# EasyEDA Pro project chunithm.epro, schematic Schematic3
Create Date: 2023-06-27; Page Name: P1; Project Name: chunithm_psoc; Schematic Name: Schematic3; Update Date: 2023-06-28; Company: 嘉立创EDA; Page Size: A3; Version: V1.0
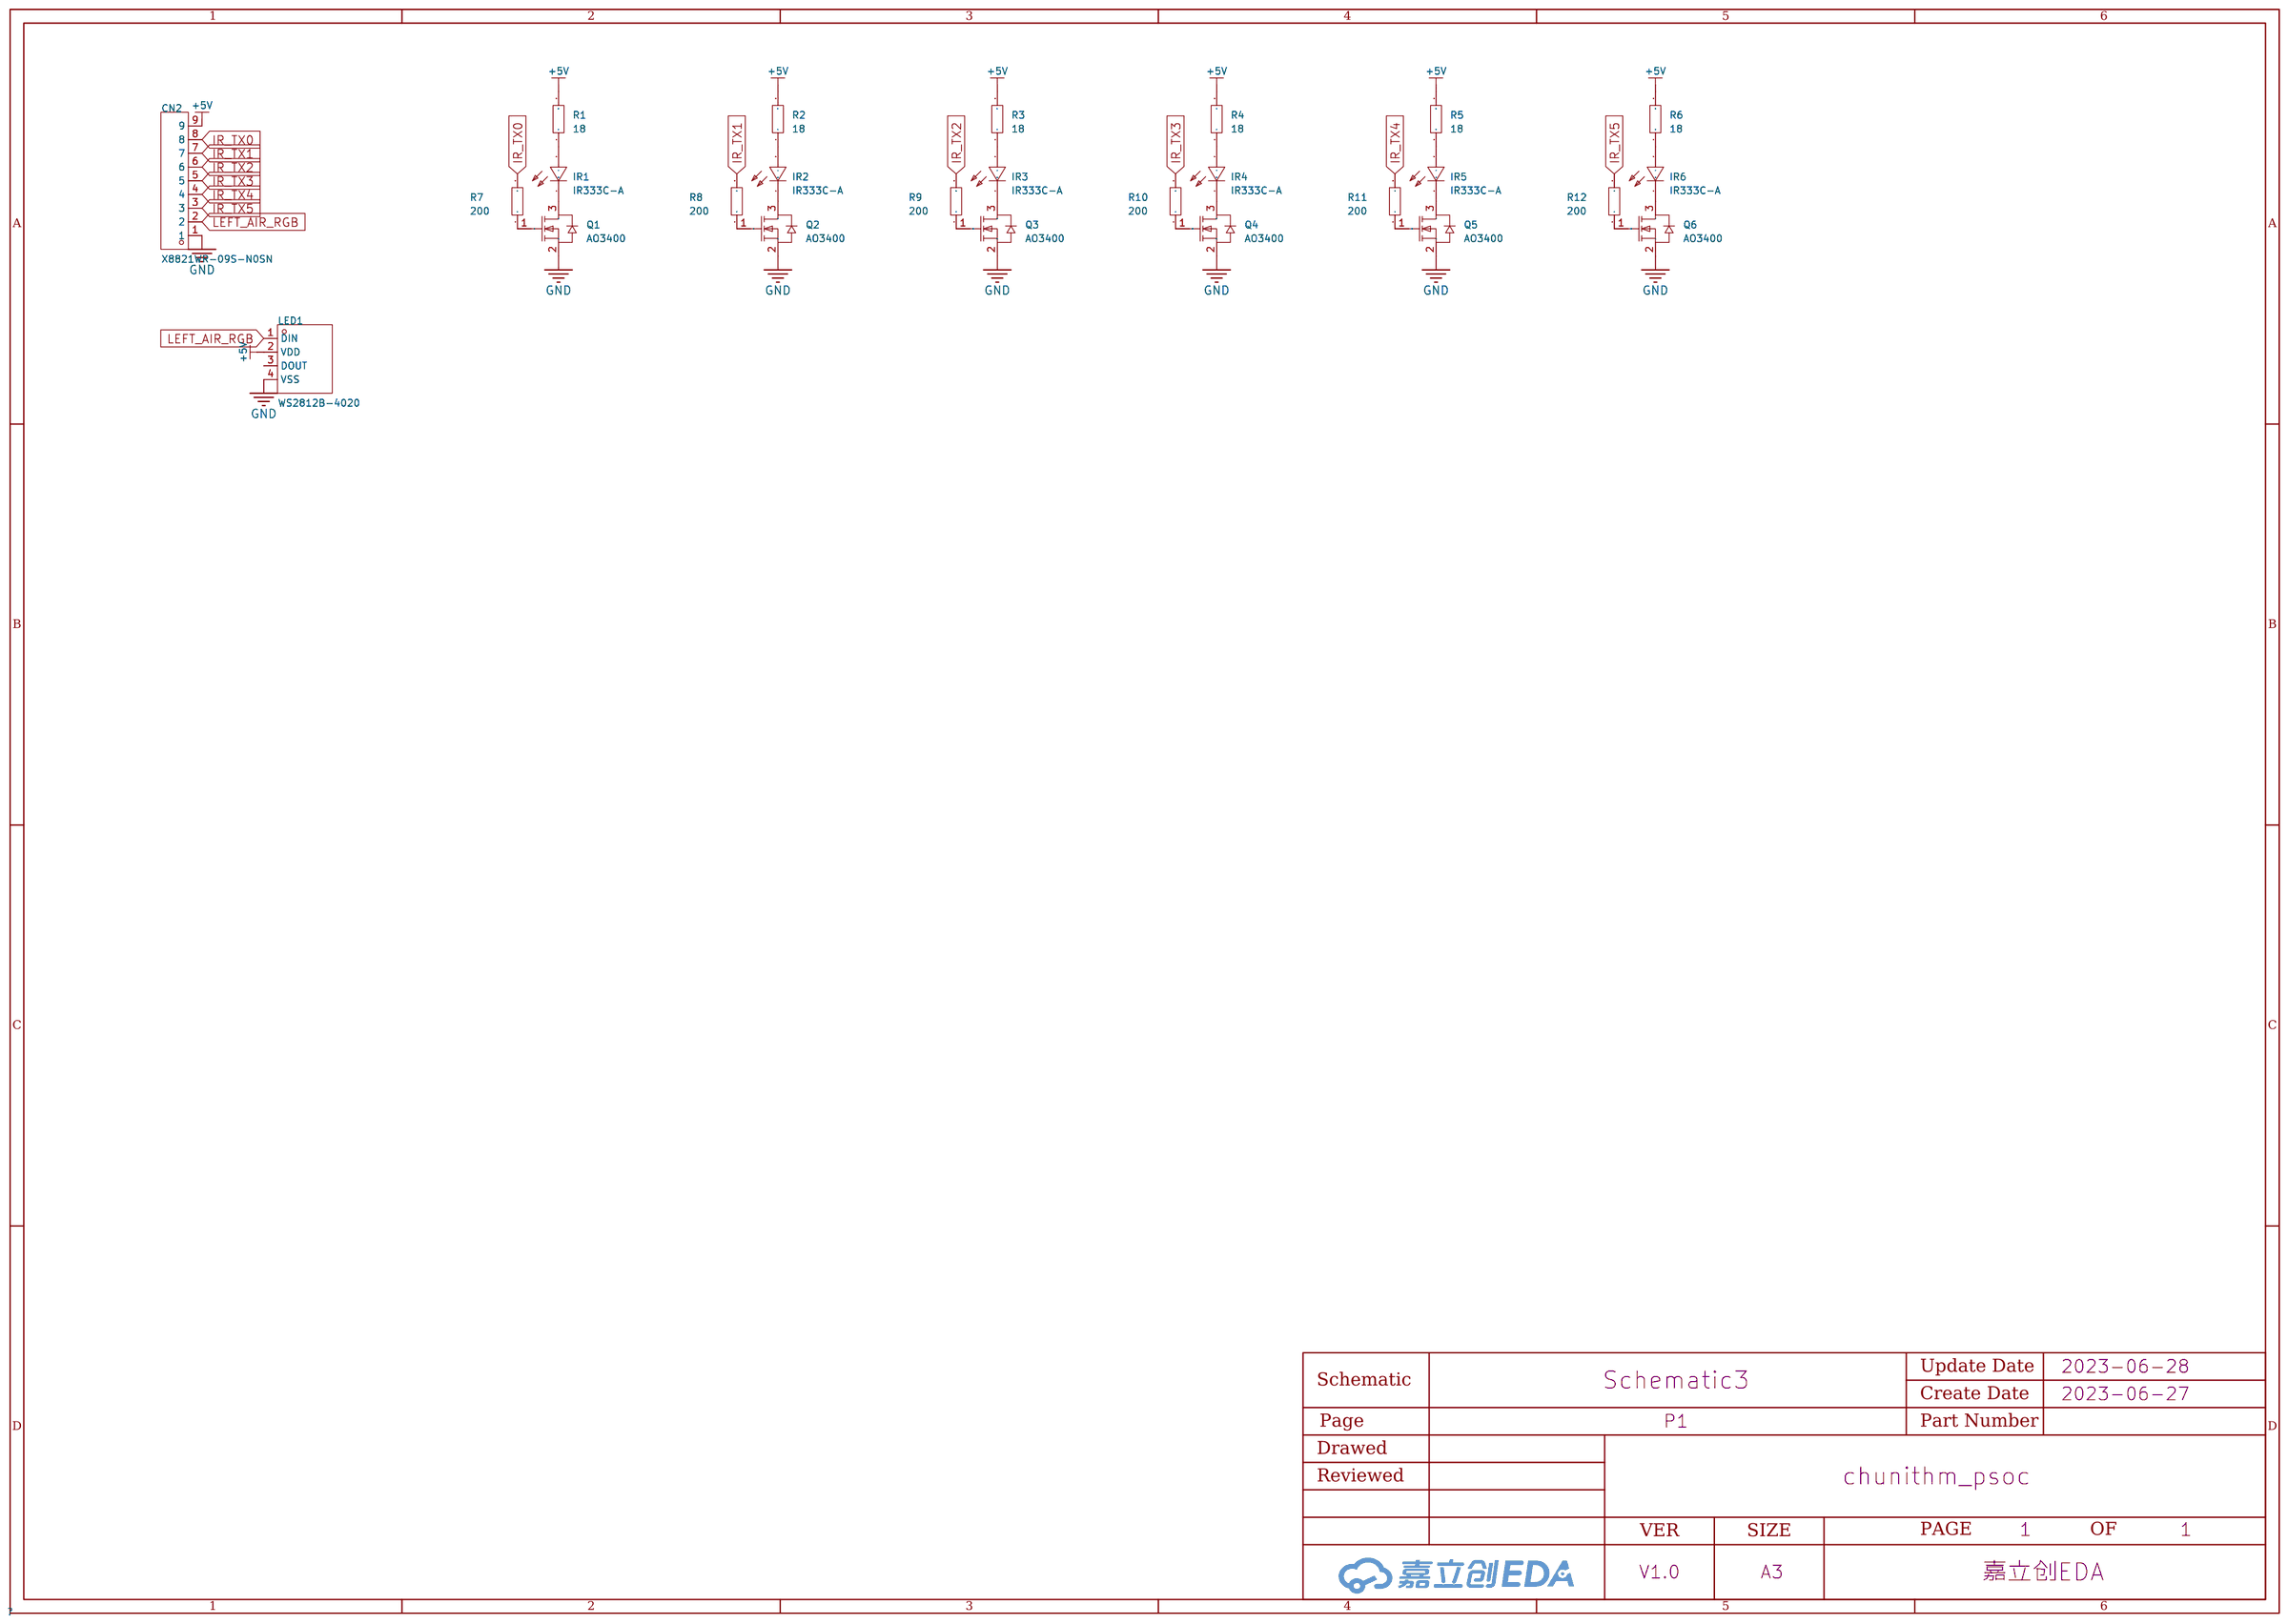
[diagram p1: schematic sheet]

## Parts
CN2  X8821WR-09S-N0SN  [CONN-TH_9P-P2.50_X8821WR-09S-N2SN]
IR1  IR333C-A  [LED-TH_BD5.9-P2.54-RD_WHITE]
IR2  IR333C-A  [LED-TH_BD5.9-P2.54-RD_WHITE]
IR3  IR333C-A  [LED-TH_BD5.9-P2.54-RD_WHITE]
IR4  IR333C-A  [LED-TH_BD5.9-P2.54-RD_WHITE]
IR5  IR333C-A  [LED-TH_BD5.9-P2.54-RD_WHITE]
IR6  IR333C-A  [LED-TH_BD5.9-P2.54-RD_WHITE]
LED1  WS2812B-4020  [LED-SMD_WS2812B-4020]
Q1  AO3400  [SOT-23_L2.9-W1.3-P1.90-LS2.4-BR]
Q2  AO3400  [SOT-23_L2.9-W1.3-P1.90-LS2.4-BR]
Q3  AO3400  [SOT-23_L2.9-W1.3-P1.90-LS2.4-BR]
Q4  AO3400  [SOT-23_L2.9-W1.3-P1.90-LS2.4-BR]
Q5  AO3400  [SOT-23_L2.9-W1.3-P1.90-LS2.4-BR]
Q6  AO3400  [SOT-23_L2.9-W1.3-P1.90-LS2.4-BR]
R1  18  [R0603]
R2  18  [R0603]
R3  18  [R0603]
R4  18  [R0603]
R5  18  [R0603]
R6  18  [R0603]
R7  200  [R0603]
R8  200  [R0603]
R9  200  [R0603]
R10  200  [R0603]
R11  200  [R0603]
R12  200  [R0603]

## Library data of the parts
CN2 = X8821WR-09S-N0SN: 参考系列:XH;间距:2.5mm;插针结构:1x9P;排数:1;每排PIN数:9;行距:-;公母:母型插口;安装方式:弯插;额定电流:3A;触头材质:黄铜;触头镀层:锡;工作温度范围:-25℃~+85℃;焊接温度(最大值):260℃;; LCSC Part Name: XH 2.5mm 1x9P 弯插 XH; Supplier Part: C388746; Manufacturer: XKB Connectivity(中国星坤); Supplier Footprint: 弯插,P=2.54mm; JLCPCB Part Class: Extended Part; Datasheet: https://atta.szlcsc.com/upload/public/pdf/source/20211009/984C14C41D2B1156BCF8EEF5D296E395.pdf; Supplier: LCSC; Reference Series: XH; Pitch: 2.5mm; Pins Structure: 1x9P; Number of Rows: 1; Number of PINs Per Row: 9; Gender: 母型插口; Mounting Style: 弯插; Current Rating (Max): 3A; Contact Material: 黄铜; Contact Plating: 锡; Operating Temperature Range: -25℃~+85℃; Welding Temperature (Max): 260℃
IR1-IR6 = IR333C-A: 辐射强度:15mW/sr @ 20mA;; LCSC Part Name: IR333C-A  Q档; Supplier Part: C5130; Manufacturer: EVERLIGHT(亿光); Supplier Footprint: 插件,D=5mm; JLCPCB Part Class: Extended Part; Datasheet: https://atta.szlcsc.com/upload/public/pdf/source/20130826/1457706640625.pdf; Supplier: LCSC; Radiant Intensity: 15mW/sr @ 20mA
LED1 = WS2812B-4020: 发光颜色:RGB三色;二极管配置:-;主波长:465nm~475nm；620nm~625nm；515nm~525nm;色温:-;功率:-;安装方式:-;; LCSC Part Name: RGB三色 （注意防潮，请查阅规格书中对应具体内容）; Supplier Part: C965557; Manufacturer: worldsemi; Supplier Footprint: SMD,2x4mm; JLCPCB Part Class: Extended Part; Datasheet: https://atta.szlcsc.com/upload/public/pdf/source/20201203/C965557_D4D919E14814D6BA44043987D39B5520.pdf; Supplier: LCSC; Emitted Color: RGB三色; Dominant Wavelength: 465nm~475nm；620nm~625nm；515nm~525nm; Forward Current: 12mA
Q1-Q6 = AO3400_C2938367: 类型:N沟道;漏源电压(Vdss):30V;连续漏极电流(Id):5.8A;功率(Pd):1.5W;导通电阻(RDS(on)@Vgs,Id):35mΩ@10V,5.8A;; LCSC Part Name: N沟道 30V 5.8A; Supplier Part: C2938367; Manufacturer: GOODWORK(固得沃克); Supplier Footprint: SOT-23; JLCPCB Part Class: Extended Part; Datasheet: https://atta.szlcsc.com/upload/public/pdf/source/20211229/1DE691E24B5B31BB262C463D0489A9AB.pdf; Supplier: LCSC; Type: N沟道; Drain Source Voltage (Vdss): 30V; Continuous Drain Current (Id): 5.8A; Power Dissipation (Pd): 1.5W; Drain Source On Resistance (RDS(on)@Vgs,Id): 35mΩ@10V,5.8A; Gate Threshold Voltage (Vgs(th)@Id): 1.2V@250uA; Input Capacitance (Ciss@Vds): 1.05nF@15V; Reverse Transfer Capacitance (Crss@Vds): 77pF@15V; Operating Temperature: +150℃@(Tj)
R1-R12 = 0603WAF1000T5E: 电阻类型:厚膜电阻;阻值:100Ω;精度:±1%;功率:100mW;; LCSC Part Name: 100Ω ±1% 100mW; Supplier Part: C22775; Manufacturer: UNI-ROYAL(厚声); Supplier Footprint: 0603; JLCPCB Part Class: Basic Part; Datasheet: https://atta.szlcsc.com/upload/public/pdf/source/20200306/C422600_1E6D84923E4A46A82E41ADD87F860B5C.pdf; Supplier: LCSC; Type: 厚膜电阻; Tolerance: ±1%; Power(Watts): 100mW; Temperature Coefficient: ±200ppm/℃; Overload Voltage (Max): 75V; Operating Temperature Range: -55℃~+155℃

## Nets
+5V: CN2.9 LED1.2(VDD) R1.2 R2.2 R3.2 R4.2 R5.2 R6.2
GND: CN2.1 LED1.4(VSS) Q1.2(S) Q2.2(S) Q3.2(S) Q4.2(S) Q5.2(S) Q6.2(S)
IR_TX0: CN2.8 R7.2
IR_TX1: CN2.7 R8.2
IR_TX2: CN2.6 R9.2
IR_TX3: CN2.5 R10.2
IR_TX4: CN2.4 R11.2
IR_TX5: CN2.3 R12.2
LEFT_AIR_RGB: CN2.2 LED1.1(DIN)
$1N667: IR1.1(C) Q1.3(D)
$1N697: IR2.1(C) Q2.3(D)
$1N727: IR3.1(C) Q3.3(D)
$1N757: IR4.1(C) Q4.3(D)
$1N787: IR5.1(C) Q5.3(D)
$1N817: IR6.1(C) Q6.3(D)
$1N915: IR2.2(A) R2.1
$1N951: IR3.2(A) R3.1
$1N987: IR4.2(A) R4.1
$1N1023: IR5.2(A) R5.1
$1N1059: IR6.2(A) R6.1
$1N1095: IR1.2(A) R1.1
$1N1288: Q2.1(G) R8.1
$1N1324: Q3.1(G) R9.1
$1N1360: Q4.1(G) R10.1
$1N1396: Q5.1(G) R11.1
$1N1432: Q6.1(G) R12.1
$1N1498: Q1.1(G) R7.1

Not connected (* = marked no-connect by the designer): LED1 3(DOUT)
